# EAGLE design energy-harvesting-demoboard_v11 (EAGLE 6.4)

## Sheet 1 of 2
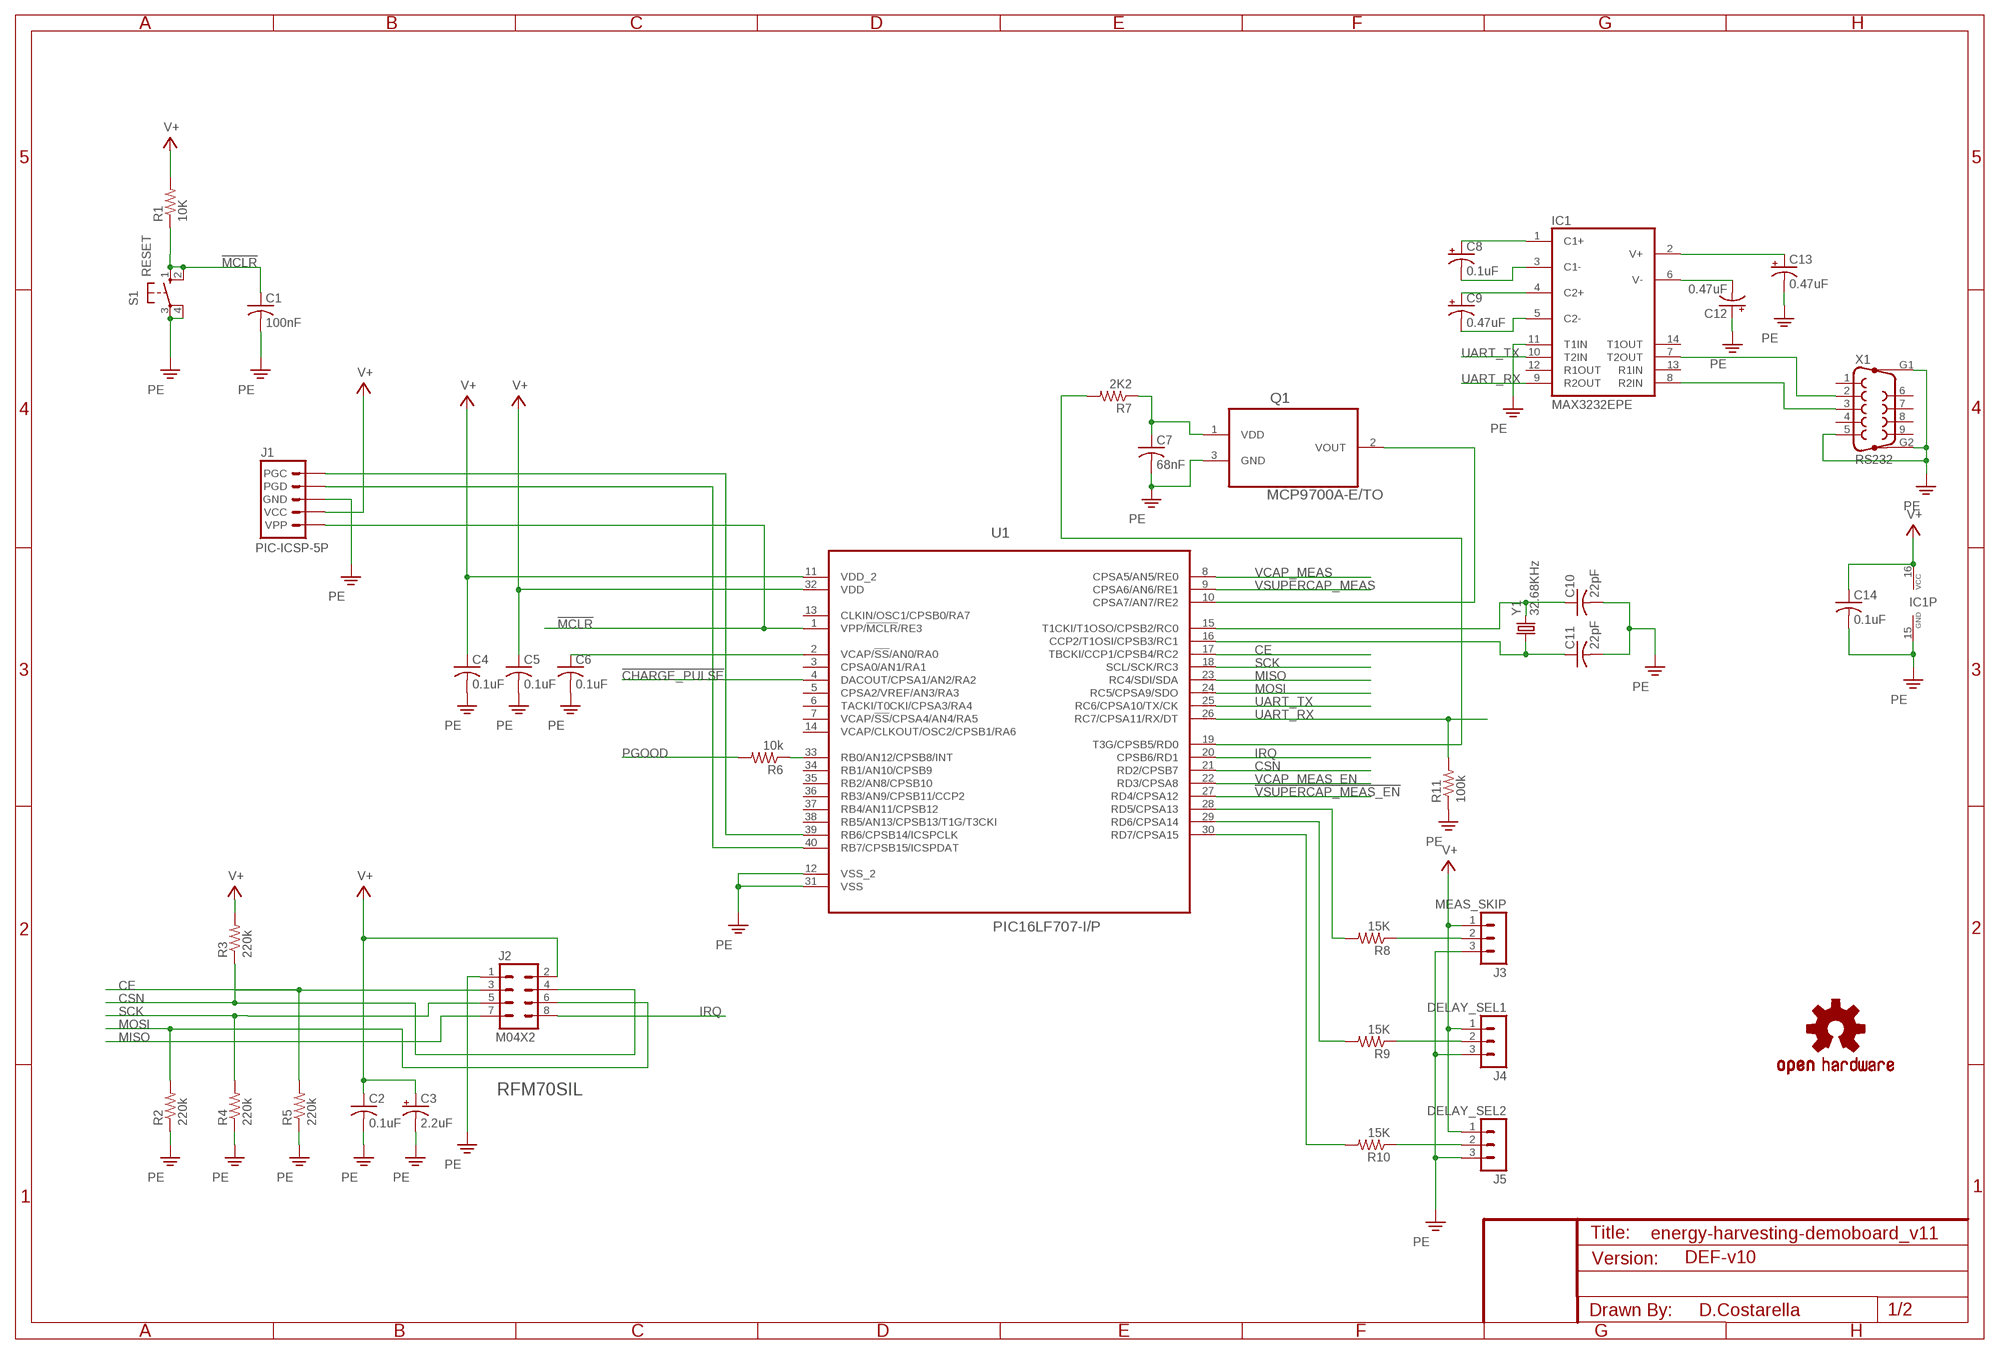
[diagram p0: schematic, sheet 1]

### Parts
C1  100nF  C-US025-025X050  [C025-025X050]
C2  0.1uF  C-US050-025X075  [C050-025X075]
C3  2.2uF  CPOL-USE2.5-5  [E2,5-5]
C4  0.1uF  C-US050-025X075  [C050-025X075]
C5  0.1uF  C-US050-025X075  [C050-025X075]
C6  0.1uF  C-US050-025X075  [C050-025X075]
C7  68nF  C-US050-035X075  [C050-035X075]
C8  0.1uF  CPOL-USE2.5-5  [E2,5-5]
C9  0.47uF  CPOL-USE2.5-5  [E2,5-5]
C10  22pF  C-US025-025X050  [C025-025X050]
C11  22pF  C-US025-025X050  [C025-025X050]
C12  0.47uF  CPOL-USE2.5-5  [E2,5-5]
C13  0.47uF  CPOL-USE2.5-5  [E2,5-5]
C14  0.1uF  C-US050-030X075  [C050-030X075]
IC1  MAX3232EPE  [DIL16]
J1  PIC-ICSP-5P  [1X05]
J2  M04X2  [2X4]
J3  MEAS_SKIP  MA03-1  [MA03-1]
J4  DELAY_SEL1  MA03-1  [MA03-1]
J5  DELAY_SEL2  MA03-1  [MA03-1]
LOGO1  OSHW-LOGOL  [OSHW-LOGO-L]
Q1  MCP9700A-E/TO  [TO127P254X533-3]
R1  10K  RESISTORPTH-1/4W  [AXIAL-0.4]
R2  220k  RESISTORPTH-1/4W  [AXIAL-0.4]
R3  220k  RESISTORPTH-1/4W  [AXIAL-0.4]
R4  220k  RESISTORPTH-1/4W  [AXIAL-0.4]
R5  220k  RESISTORPTH-1/4W  [AXIAL-0.4]
R6  10k  RESISTORPTH-1/4W  [AXIAL-0.4]
R7  2K2  RESISTORPTH-1/4W  [AXIAL-0.4]
R8  15K  RESISTORPTH-1/4W  [AXIAL-0.4]
R9  15K  RESISTORPTH-1/4W  [AXIAL-0.4]
R10  15K  RESISTORPTH-1/4W  [AXIAL-0.4]
R11  100k  RESISTORPTH-1/4W  [AXIAL-0.4]
S1  RESET  10-XX  [B3F-10XX]
U1  PIC16LF707-I/P  PIC16F707-I/P  [DIP254P1524X635-40]
X1  RS232  F09HP  [F09HP]
Y1  32.68KHz  CRYSTALTC26H_EZ  [TC26HEZ]

### Nets
!CHARGE_PULSE: U1.4(DACOUT/CPSA1/AN2/RA2) ; also sheet 2
!MCLR: C1.1 J1.1(VPP) R1.P$1 S1.1(S) S1.2(S1) U1.1(VPP/!MCLR!/RE3)
!VSUPERCAP_MEAS_EN: U1.27(RD4/CPSA12) ; also sheet 2
CE: J2.3 R5.P$2 U1.17(TBCKI/CCP1/CPSB4/RC2)
CSN: J2.4 R3.P$1 U1.21(RD2/CPSB7)
IRQ: J2.8 U1.20(CPSB6/RD1)
MISO: J2.7 U1.23(RC4/SDI/SDA)
MOSI: J2.6 R2.P$2 U1.24(RC5/CPSA9/SDO)
N$1: J1.5(PGC) U1.39(RB6/CPSB14/ICSPCLK)
N$2: J1.4(PGD) U1.40(RB7/CPSB15/ICSPDAT)
N$3: C6.1 U1.2(VCAP/!SS!/AN0/RA0)
N$4: C10.1 U1.15(T1CKI/T1OSO/CPSB2/RC0) Y1.2
N$5: C11.1 U1.16(CCP2/T1OSI/CPSB3/RC1) Y1.1
N$6: Q1.2(VOUT) U1.10(CPSA7/AN7/RE2)
N$7: J3.2 R8.P$1
N$8: R8.P$2 U1.28(RD5/CPSA13)
N$9: J4.2 R9.P$1
N$10: J5.2 R10.P$1
N$11: R9.P$2 U1.29(RD6/CPSA14)
N$12: R10.P$2 U1.30(RD7/CPSA15)
N$13: C7.1 Q1.1(VDD) R7.P$1
N$14: C8.+ IC1.1(C1+)
N$15: C8.- IC1.3(C1-)
N$16: C9.+ IC1.4(C2+)
N$17: C9.- IC1.5(C2-)
N$18: C12.- IC1.6(V-)
N$19: C13.+ IC1.2(V+)
N$20: IC1.8(R2IN) X1.3
N$25: IC1.7(T2OUT) X1.2
N$49: R6.P$1 U1.33(RB0/AN12/CPSB8/INT)
PE: C1.2 C2.2 C3.- C4.2 C5.2 C6.2 C7.2 C10.2 C11.2 C12.+ C13.- C14.2 IC1.11(T1IN) IC1.15(GND) J1.3(GND) J2.1 J3.3 J4.3 J5.3 Q1.3(GND) R2.P$1 R4.P$1 R5.P$1 R11.P$1 S1.3(P) S1.4(P1) U1.12(VSS_2) U1.31(VSS) X1.5 X1.G1 X1.G2 ; also sheet 2
PGOOD: R6.P$2 ; also sheet 2
SCK: J2.5 R4.P$2 U1.18(SCL/SCK/RC3)
SENS_EN: R7.P$2 U1.19(T3G/CPSB5/RD0)
UART_RX: IC1.9(R2OUT) R11.P$2 U1.26(RC7/CPSA11/RX/DT)
UART_TX: IC1.10(T2IN) U1.25(RC6/CPSA10/TX/CK)
V+: C2.1 C3.+ C4.1 C5.1 C14.1 IC1.16(VCC) J1.2(VCC) J2.2 J3.1 J4.1 J5.1 R1.P$2 R3.P$2 U1.11(VDD_2) U1.32(VDD) ; also sheet 2
VCAP_MEAS: U1.8(CPSA5/AN5/RE0) ; also sheet 2
VCAP_MEAS_EN: U1.22(RD3/CPSA8) ; also sheet 2
VSUPERCAP_MEAS: U1.9(CPSA6/AN6/RE1) ; also sheet 2
Unconnected: IC1.12(R1OUT) IC1.13(R1IN) IC1.14(T1OUT) U1.3(CPSA0/AN1/RA1) U1.5(CPSA2/VREF/AN3/RA3) U1.6(TACKI/T0CKI/CPSA3/RA4) U1.7(VCAP/!SS!/CPSA4/AN4/RA5) U1.13(CLKIN/OSC1/CPSB0/RA7) U1.14(VCAP/CLKOUT/OSC2/CPSB1/RA6) U1.34(RB1/AN10/CPSB9) U1.35(RB2/AN8/CPSB10) U1.36(RB3/AN9/CPSB11/CCP2) U1.37(RB4/AN11/CPSB12) U1.38(RB5/AN13/CPSB13/T1G/T3CKI) X1.1 X1.4 X1.6 X1.7 X1.8 X1.9

### Notes on the sheet
- RFM70SIL
- DEF-v10
- D.Costarella

## Sheet 2 of 2
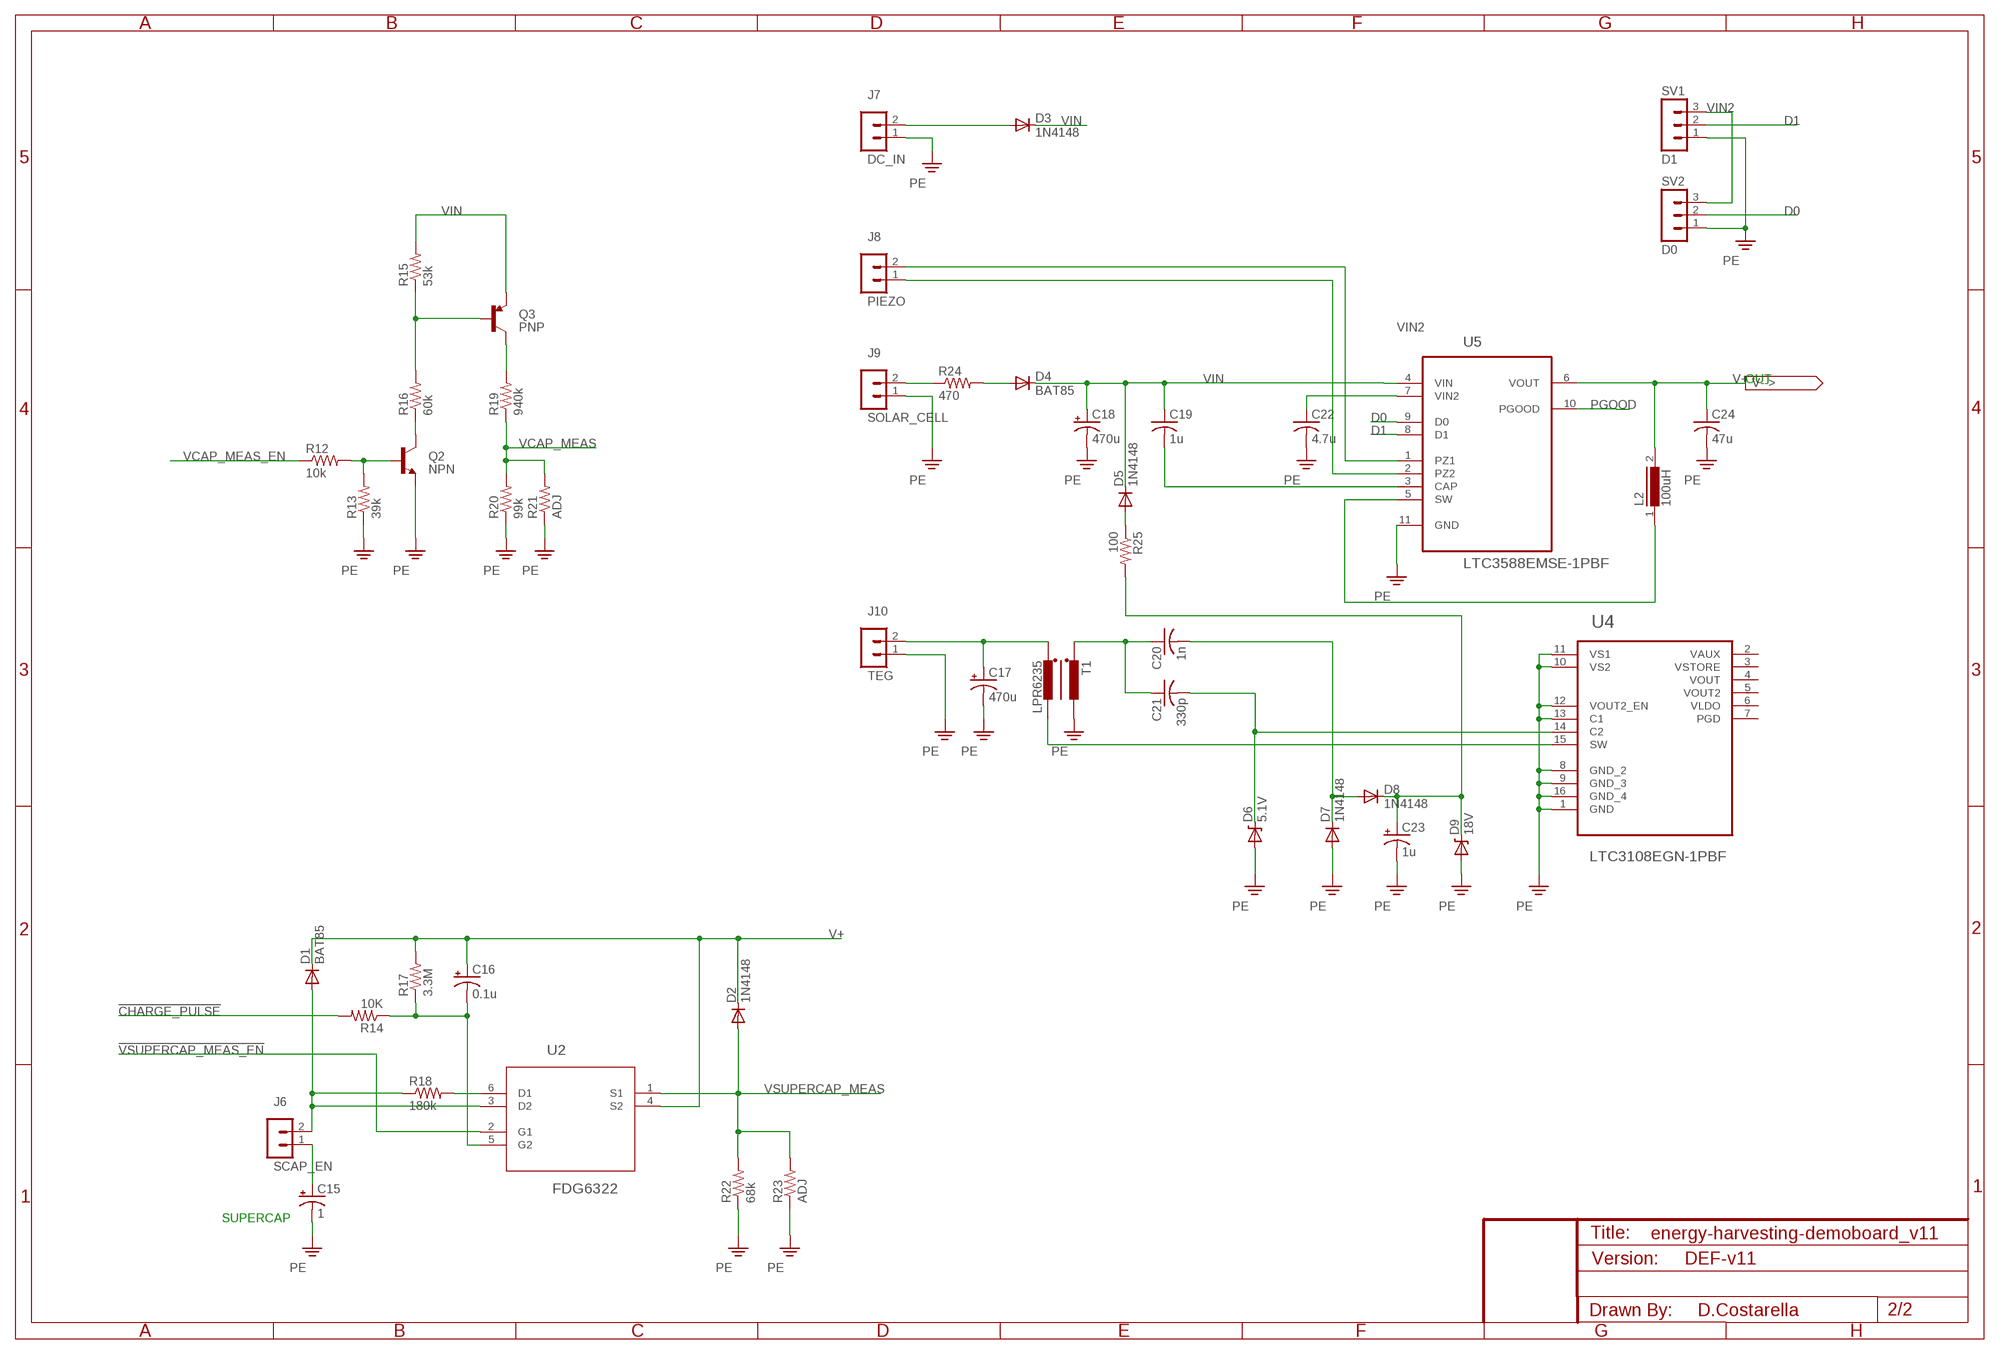
[diagram p1: schematic, sheet 2]

### Parts
C15  1  CPOL-USE5-8.5  [E5-8,5]
C16  0.1u  CPOL-USE2.5-5  [E2,5-5]
C17  470u  CPOL-USE5-10.5  [E5-10,5]
C18  470u  CPOL-USE5-10.5  [E5-10,5]
C19  1u  C-US050-035X075  [C050-035X075]
C20  1n  C-US050-030X075  [C050-030X075]
C21  330p  C-US050-030X075  [C050-030X075]
C22  4.7u  C-US025-024X044  [C025-024X044]
C23  1u  CPOL-USE2,5-6E  [E2,5-6E]
C24  47u  C-US050-025X075  [C050-025X075]
D1  BAT85  DIODE1N4148  [DIODE-1N4148]
D2  1N4148  DIODE1N4148  [DIODE-1N4148]
D3  1N4148  DIODESMA  [SMA-DIODE]
D4  BAT85  DIODE1N4148  [DIODE-1N4148]
D5  1N4148  DIODESMA  [SMA-DIODE]
D6  5.1V  DIODE-ZENERPTH  [DIODE-ZENER]
D7  1N4148  DIODE1N4148  [DIODE-1N4148]
D8  1N4148  DIODE1N4148  [DIODE-1N4148]
D9  18V  DIODE-ZENERPTH  [DIODE-ZENER]
J6  SCAP_EN  MA02-1  [MA02-1]
J7  DC_IN  MA02-1  [MA02-1]
J8  PIEZO  MA02-1  [MA02-1]
J9  SOLAR_CELL  MA02-1  [MA02-1]
J10  TEG  MA02-1  [MA02-1]
L2  100uH  DR125  [DR125]
Q2  NPN  TRANSISTOR_NPN_2PTH  [TO-92]
Q3  PNP  TRANSISTOR_PNPTO92  [TO-92]
R12  10k  RESISTORPTH-1/4W  [AXIAL-0.4]
R13  39k  RESISTORPTH-1/4W  [AXIAL-0.4]
R14  10K  RESISTORPTH-1/4W  [AXIAL-0.4]
R15  53k  RESISTORPTH-1/4W  [AXIAL-0.4]
R16  60k  RESISTORPTH-1/4W  [AXIAL-0.4]
R17  3.3M  RESISTORPTH-1/4W  [AXIAL-0.4]
R18  180k  RESISTORPTH-1/4W  [AXIAL-0.4]
R19  940k  RESISTORPTH-1/4W  [AXIAL-0.4]
R20  99k  RESISTORPTH-1/4W  [AXIAL-0.4]
R21  ADJ  RESISTORPTH-1/4W  [AXIAL-0.4]
R22  68k  RESISTORPTH-1/4W  [AXIAL-0.4]
R23  ADJ  RESISTORPTH-1/4W  [AXIAL-0.4]
R24  470  RESISTORPTH-1/4W  [AXIAL-0.4]
R25  100  RESISTORPTH-1/4W  [AXIAL-0.4]
SV1  D1  MA03-1  [MA03-1]
SV2  D0  MA03-1  [MA03-1]
T1  LPR6235  [LPR6235]
U2  FDG6322  BSS138PS  [SOT65P210X110-6N]
U4  LTC3108EGN-1PBF  [SOP63P600X175-16N]
U5  LTC3588EMSE-1PBF  [SOP50P490X110-11N]

### Nets
!CHARGE_PULSE: R14.P$2 ; also sheet 1
!VSUPERCAP_MEAS_EN: U2.2(G1) ; also sheet 1
D0: SV2.2 U5.9(D0)
D1: SV1.2 U5.8(D1)
N$21: Q2.2(B) R12.P$2 R13.P$2
N$22: Q2.1(C) R16.P$1
N$23: Q3.2(B) R15.P$1 R16.P$2
N$24: J8.1 U5.2(PZ2)
N$26: Q3.3(C) R19.P$2
N$27: D1.A J6.2 R18.P$1 U2.3(D2)
N$28: R18.P$2 U2.6(D1)
N$29: J9.2 R24.P$1
N$30: J8.2 U5.1(PZ1)
N$31: L2.1 U5.5(SW)
N$32: C19.2 U5.3(CAP)
N$34: C15.+ J6.1
N$36: C23.+ D8.C D9.P$1(C) R25.P$2
N$37: C21.2 D6.P$1(C) U4.14(C2)
N$38: D3.A J7.2
N$40: C17.+ J10.2 T1.P$1
N$41: D5.A R25.P$1
N$42: C20.2 D7.C D8.A
N$43: C16.- R14.P$1 R17.P$1 U2.5(G2)
N$44: D4.A R24.P$2
N$45: T1.P$2 U4.15(SW)
N$47: C20.1 C21.1 T1.P$4
PE: C15.- C17.- C18.- C22.2 C23.- C24.2 D6.P$2(A) D7.A D9.P$2(A) J7.1 J9.1 J10.1 Q2.3(E) R13.P$1 R20.P$1 R21.P$1 R22.P$1 R23.P$1 SV1.1 SV2.1 T1.P$3 U4.1(GND) U4.8(GND_2) U4.9(GND_3) U4.10(VS2) U4.11(VS1) U4.12(VOUT2_EN) U4.13(C1) U4.16(GND_4) U5.11(GND) ; also sheet 1
PGOOD: U5.10(PGOOD) ; also sheet 1
V+: C16.+ C24.1 D1.C D2.C L2.2 R17.P$2 U2.4(S2) U5.6(VOUT) ; also sheet 1
VCAP_MEAS: R19.P$1 R20.P$2 R21.P$2 ; also sheet 1
VCAP_MEAS_EN: R12.P$1 ; also sheet 1
VIN: C18.+ C19.1 D3.C D4.C D5.C Q3.1(E) R15.P$2 U5.4(VIN)
VIN2: C22.1 SV1.3 SV2.3 U5.7(VIN2)
VSUPERCAP_MEAS: D2.A R22.P$2 R23.P$2 U2.1(S1) ; also sheet 1
Unconnected: U4.2(VAUX) U4.3(VSTORE) U4.4(VOUT) U4.5(VOUT2) U4.6(VLDO) U4.7(PGD)

### Notes on the sheet
- OUT
- SUPERCAP
- DEF-v11
- D.Costarella

## Library data of the parts
C1 C2 C4-C7 C10 C11 C14 C19-C22 C24 = energy-harvesting:C-US: CAPACITOR, American symbol
C3 C8 C9 C12 C13 C15-C18 C23 = rcl:CPOL-US: POLARIZED CAPACITOR, American symbol
D1-D5 D7 D8 = SparkFun-DiscreteSemi:DIODE: Diode These are standard reverse protection diodes and small signal diodes. SMA package can handle up to about 1A. SOD-323 can handle about 200mA. What the SOD-323 package when ordering, there are some mfgs out there that are 5-pin packages.
D6 D9 = SparkFun-DiscreteSemi:DIODE-ZENER: Zener Diode Production Part - 8199 3.4V Zener Voltage
IC1 = maxim:MAX3232*: True RS-232 Transceivers 3.0V to 5.5V, Low-Power up to 1Mbps, Using Four 0.1µF External Capacitors Source: http://pdfserv.maxim-ic.com/en/ds/MAX3222-MAX3241.pdf; MPN: MAX3232EPE+; OC_FARNELL: unknown; OC_NEWARK: 67K4860
J1 = SparkFun-Connectors:PIC-ICSP-5P
J2 = SparkFun-Connectors:M04X2: .1" header, two rows of four.
J3-J5 SV1 SV2 = con-lstb:MA03-1: PIN HEADER; OC_FARNELL: unknown; OC_NEWARK: unknown
J6-J10 = con-lstb:MA02-1
L2 = inductors:DR125: High Power Density, High Efficiency, Shielded Inductors Source: coiltronics_dr_series.pdf
LOGO1 = SparkFun-Aesthetics:OSHW-LOGO: Open Source Hardware Logo This logo indicates the piece of hardware it is found on incorporates a OSHW license and/or adheres to the definition of open source hardware found here: http://freedomdefined.org/OSHW
Q1 = Microchip_By_element14_Batch_1:MCP9700A-E/TO: THERMISTOR, LINEAR 10MV/C; MPN: MCP9700A-E/TO; OC_FARNELL: 1332164; OC_NEWARK: 17M0676; PACKAGE: TO-92-3; SUPPLIER: Microchip
Q2 = SparkFun-DiscreteSemi:TRANSISTOR_NPN_2: Alternate TO-92 NPN BJT
Q3 = SparkFun-DiscreteSemi:TRANSISTOR_PNP: Generic PNP BJT. Double check pinouts against datasheets- not all devices are the same!
R1-R25 = SparkFun-Passives:RESISTOR: Resistor Basic schematic elements and footprints for 0603, 1206, and PTH resistors.
S1 = switch-omron:10-XX: OMRON SWITCH; MPN: B3F-1000; OC_FARNELL: 176432; OC_NEWARK: 36M3542
T1 = energy-harvesting:LPR6235
U1 = energy-harvesting:PIC16F707-I/P: 8-Bit CMOS Microcontrollers; MPN: PIC16F707-I/P; OC_FARNELL: 1814952; OC_NEWARK: 63R7804; PACKAGE: DIP-40; SUPPLIER: Microchip
U2 = NXP_By_element14_Batch_1:BSS138PS: Dual N-channel Trench MOSFET; MPN: BSS138PS; OC_FARNELL: 1972664; OC_NEWARK: 58T9002; PACKAGE: SOT-363-6; SUPPLIER: NXP
U4 = LTC_By_element14_Batch_1:LTC3108EGN-1PBF: Ultralow Voltage Step-Up Converter and Power Manager; MPN: LTC3108EGN-1#PBF; OC_FARNELL: 1839096; OC_NEWARK: 13T8313; PACKAGE: SSOP-16; SUPPLIER: Linear Technology
U5 = LTC_By_element14_Batch_1:LTC3588EMSE-1PBF: Piezoelectric Energy Harvesting Power Supply; MPN: LTC3588EMSE-1#PBF; OC_FARNELL: 1839154; OC_NEWARK: 63R1666; PACKAGE: MSOP-10; SUPPLIER: Linear Technology
X1 = con-subd:F09HP: SUB-D; OC_FARNELL: unknown; OC_NEWARK: unknown
Y1 = SparkFun-FreqCtrl:CRYSTAL: Various standard crystals. Proven footprints. Spark Fun Electronics SKU : COM-00534

## Board
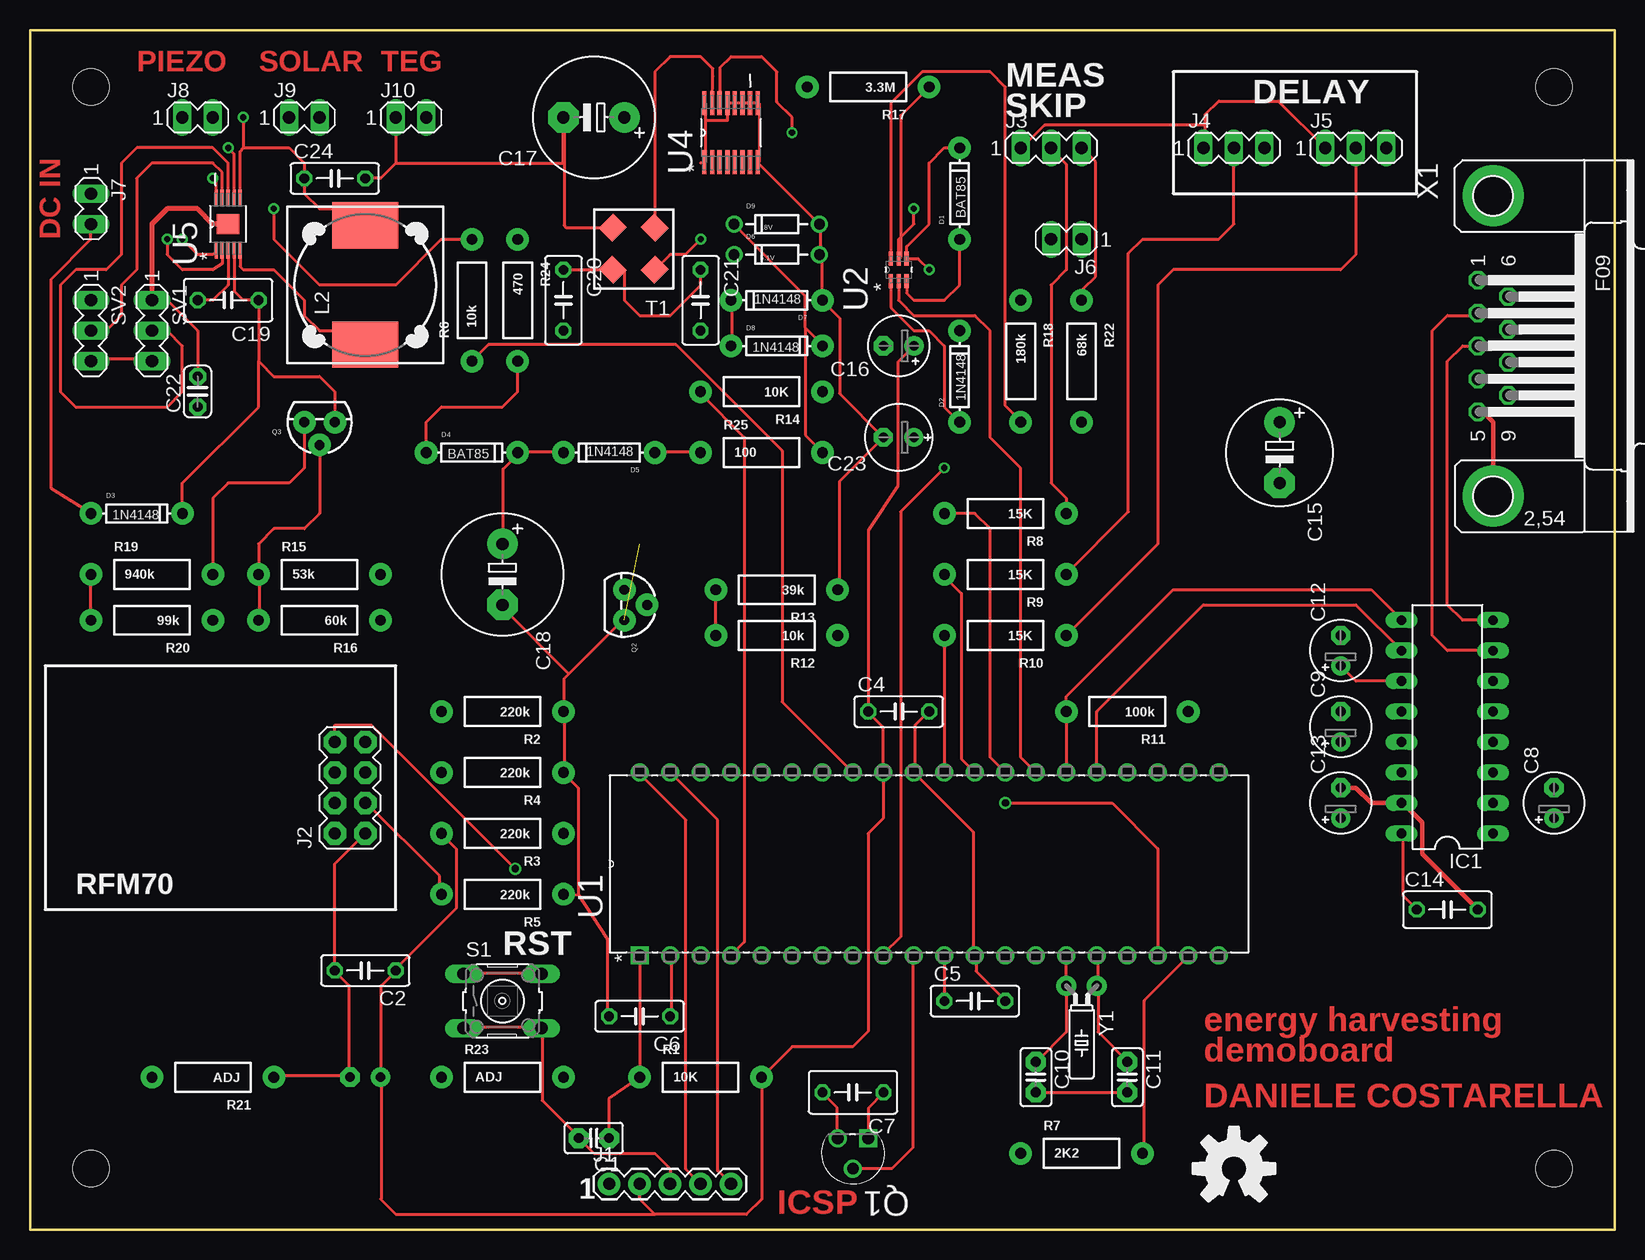
[diagram p2: board, top side]
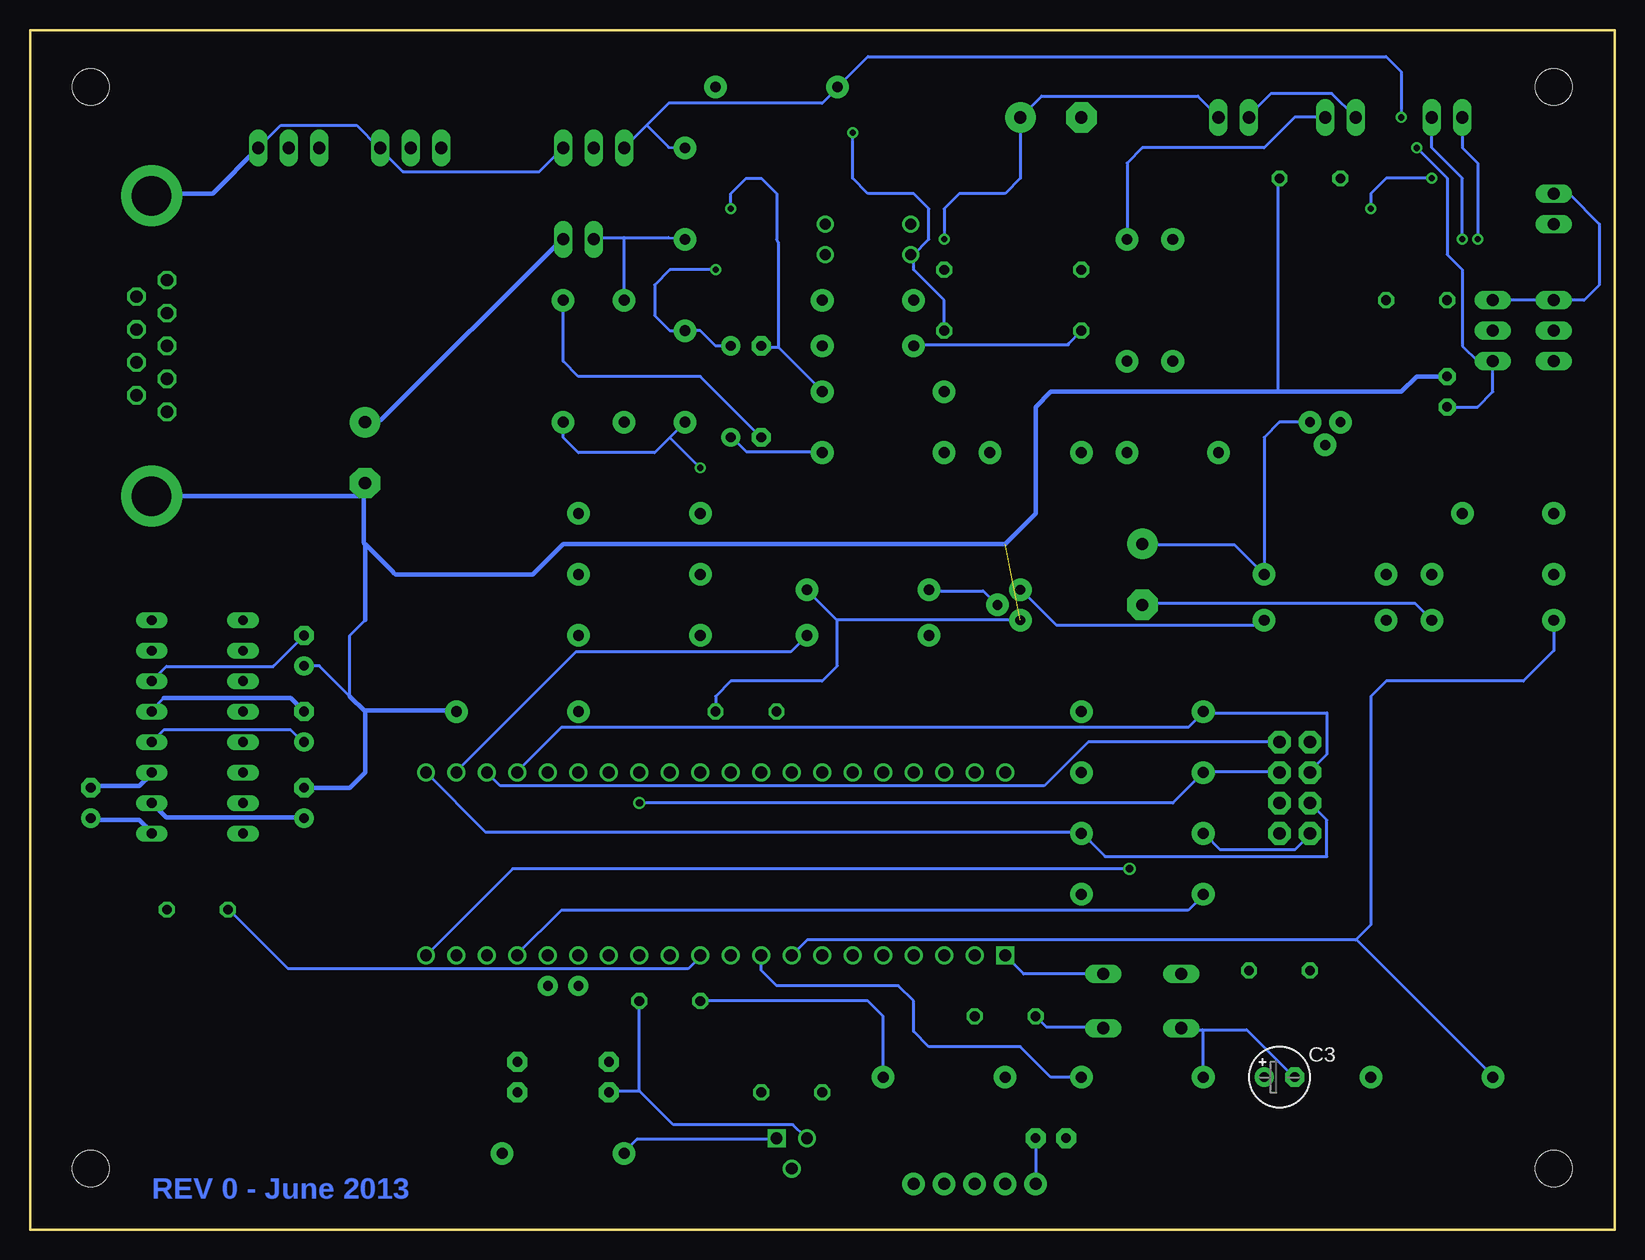
[diagram p3: board, bottom side, seen from below]

Size 132.06 x 100 mm. Coordinates in mm from the lower left corner, seen from the top.
Outline: 0,0 132.06,0 132.06,100 0,100 0,0
Copper layers (1*16): Top 0.035mm / dielectric 1.5mm / Bottom 0.035mm
Design rules "default": minimum track width 10mil, minimum drill 24mil, track to track 8mil, track to pad 8mil, pad to pad 8mil, via to via 8mil, smd to smd 8mil, copper to edge 40mil, drill to drill 8mil, minimum pad ring 10mil, minimum via ring 8mil, stop-mask expansion 4mil, vias tented up to drill 0mil, thermal gap 10mil
Holes 3.05 mm at 127,95.25 127,5.08 5.08,5.08 5.08,95.25

### Footprints (pad centres in the part's own frame; a part is rotated, then mirrored left to right if it is on the bottom)
C025-025X050 = drill 0.813 pad 1.676 octagon: 1 -1.27,0; 2 1.27,0
C050-025X075 = drill 0.813 octagon: 1 -2.54,0; 2 2.54,0
E2,5-5 = drill 0.813 pad 1.6: + -1.27,0 | drill 0.813 pad 1.6 octagon: - 1.27,0
C050-035X075 = drill 0.813 octagon: 1 -2.54,0; 2 2.54,0
C050-030X075 = drill 0.813 octagon: 1 -2.54,0; 2 2.54,0
E5-8,5 = drill 1.016 pad 2.54: + -2.54,0 | drill 1.016 pad 2.54 octagon: - 2.54,0
E5-10,5 = drill 1.016 pad 2.54: + -2.54,0 | drill 1.016 pad 2.54 octagon: - 2.54,0
C025-024X044 = drill 0.813 pad 1.422 octagon: 1 -1.27,0; 2 1.27,0
E2,5-6E = drill 0.813 pad 1.575: + -1.27,0 | drill 0.813 pad 1.575 octagon: - 1.27,0
DIODE-1N4148 = drill 0.9 pad 1.88: A -3.81,0; C 3.81,0
DIODE-ZENER = drill 0.9: P$1 -3.556,0; P$2 3.556,0
DIL16 = drill 0.813 long: 1 -8.89,-3.81; 2 -6.35,-3.81; 3 -3.81,-3.81; 4 -1.27,-3.81; 5 1.27,-3.81; 6 3.81,-3.81; 7 6.35,-3.81; 8 8.89,-3.81; 9 8.89,3.81; 10 6.35,3.81; 11 3.81,3.81; 12 1.27,3.81; 13 -1.27,3.81; 14 -3.81,3.81; 15 -6.35,3.81; 16 -8.89,3.81
1X05 = drill 1.016 pad 1.88: 1 0,0; 2 2.54,0; 3 5.08,0; 4 7.62,0; 5 10.16,0
2X4 = drill 1.016 pad 1.88 octagon: 1 -3.81,-1.27; 2 -3.81,1.27; 3 -1.27,-1.27; 4 -1.27,1.27; 5 1.27,-1.27; 6 1.27,1.27; 7 3.81,-1.27; 8 3.81,1.27
MA03-1 = drill 1.016 long: 1 -2.54,0; 2 0,0; 3 2.54,0
MA02-1 = drill 1.016 long: 1 -1.27,0; 2 1.27,0
DR125 = smd 3.85 x 5.5: 1 -4.975,0; 2 4.975,0
TO127P254X533-3 = drill 0.991 square: 1 -2.54,-2.54 | drill 0.991: 2 -1.27,0; 3 0,-2.54
TO-92 = drill 0.813 pad 1.88: 1 -1.27,0; 2 0,1.905; 3 1.27,0
AXIAL-0.4 = drill 0.9 pad 1.88: P$1 -5.08,0; P$2 5.08,0
B3F-10XX = drill 1.016 long: 1 -3.251,2.261; 2 3.251,2.261; 3 -3.251,-2.261; 4 3.251,-2.261
LPR6235 = smd 1.7 x 1.6 rotated 45: P$1 0,0; P$3 3.5,-3.5 | smd 1.7 x 1.6 rotated 135: P$2 0,-3.5; P$4 3.5,0
DIP254P1524X635-40 = drill 0.991 square: 1 -7.62,24.13 | drill 0.991: 2 -7.62,21.59; 3 -7.62,19.05; 4 -7.62,16.51; 5 -7.62,13.97; 6 -7.62,11.43; 7 -7.62,8.89; 8 -7.62,6.35; 9 -7.62,3.81; 10 -7.62,1.27; 11 -7.62,-1.27; 12 -7.62,-3.81; 13 -7.62,-6.35; 14 -7.62,-8.89; 15 -7.62,-11.43; 16 -7.62,-13.97; 17 -7.62,-16.51; 18 -7.62,-19.05; 19 -7.62,-21.59; 20 -7.62,-24.13; 21 7.62,-24.13; 22 7.62,-21.59; 23 7.62,-19.05; 24 7.62,-16.51; 25 7.62,-13.97; 26 7.62,-11.43; 27 7.62,-8.89; 28 7.62,-6.35; 29 7.62,-3.81; 30 7.62,-1.27; 31 7.62,1.27; 32 7.62,3.81; 33 7.62,6.35; 34 7.62,8.89; 35 7.62,11.43; 36 7.62,13.97; 37 7.62,16.51; 38 7.62,19.05; 39 7.62,21.59; 40 7.62,24.13
SOT65P210X110-6N = smd 1.168 x 0.356: 1 -0.94,0.66; 2 -0.94,0; 3 -0.94,-0.66; 4 0.94,-0.66; 5 0.94,0; 6 0.94,0.66
SOP63P600X175-16N = smd 1.981 x 0.356: 1 -2.464,2.235; 2 -2.464,1.575; 3 -2.464,0.965; 4 -2.464,0.305; 5 -2.464,-0.305; 6 -2.464,-0.965; 7 -2.464,-1.575; 8 -2.464,-2.235; 9 2.464,-2.235; 10 2.464,-1.575; 11 2.464,-0.965; 12 2.464,-0.305; 13 2.464,0.305; 14 2.464,0.965; 15 2.464,1.575; 16 2.464,2.235
SOP50P490X110-11N = smd 1.397 x 0.279: 1 -2.184,0.991; 2 -2.184,0.508; 3 -2.184,0; 4 -2.184,-0.508; 5 -2.184,-0.991; 6 2.184,-0.991; 7 2.184,-0.508; 8 2.184,0; 9 2.184,0.508; 10 2.184,0.991 | smd 1.676 x 1.88: 11 0,0
F09HP = drill 1.016 octagon: 1 -5.486,-1.27; 2 -2.743,-1.27; 3 0,-1.27; 4 2.743,-1.27; 5 5.486,-1.27; 6 -4.115,1.27; 7 -1.372,1.27; 8 1.372,1.27; 9 4.115,1.27 | drill 3.302 pad 5.08: G1 -12.522,0; G2 12.522,0
TC26HEZ = drill 0.813 pad 1.676: 1 -1.27,0; 2 1.27,0

### Placement (x,y rotation side)
C1  46.99,7.62 180 top
C2  27.94,21.59 180 top
C3  27.94,12.7 0 bottom
C4  72.39,43.18 0 top
C5  78.74,19.05 0 top
C6  50.8,17.78 180 top
C7  68.58,11.43 180 top
C8  127,35.56 90 top
C9  109.22,41.91 90 top
C10  83.82,12.7 270 top
C11  91.44,12.7 270 top
C12  109.22,48.26 90 top
C13  109.22,35.56 90 top
C14  118.11,26.67 0 top
C15  104.14,64.77 270 top
C16  72.39,73.66 180 top
C17  46.99,92.71 180 top
C18  39.37,54.61 270 top
C19  16.51,77.47 180 top
C20  44.45,77.47 270 top
C21  55.88,77.47 270 top
C22  13.97,69.85 90 top
C23  72.39,66.04 180 top
C24  25.4,87.63 0 top
D1  77.47,86.36 90 top
D2  77.47,71.12 90 top
D3  1N4148  [DIODE-1N4148]  8.89,59.69 0 top
D4  36.83,64.77 0 top
D5  1N4148  [DIODE-1N4148]  48.26,64.77 180 top
D6  62.23,81.28 0 top
D7  62.23,77.47 180 top
D8  62.23,73.66 0 top
D9  62.23,83.82 0 top
IC1  118.11,41.91 90 top
J1  48.26,3.81 0 top
J2  26.67,36.83 90 top
J3  85.09,90.17 0 top
J4  100.33,90.17 0 top
J5  110.49,90.17 0 top
J6  86.36,82.55 180 top
J7  5.08,85.09 270 top
J8  13.97,92.71 0 top
J9  22.86,92.71 0 top
J10  31.75,92.71 0 top
L2  27.94,78.74 90 top
LOGO1  100.33,5.08 0 top
Q1  67.31,5.08 180 top
Q2  49.53,52.07 270 top
Q3  24.13,67.31 180 top
R1  55.88,12.7 0 top
R2  39.37,43.18 180 top
R3  39.37,33.02 180 top
R4  39.37,38.1 180 top
R5  39.37,27.94 180 top
R6  36.83,77.47 90 top
R7  87.63,6.35 0 top
R8  81.28,59.69 180 top
R9  81.28,54.61 180 top
R10  81.28,49.53 180 top
R11  91.44,43.18 180 top
R12  62.23,49.53 180 top
R13  62.23,53.34 180 top
R14  60.96,69.85 180 top
R15  24.13,54.61 0 top
R16  24.13,50.8 180 top
R17  69.85,95.25 180 top
R18  82.55,72.39 270 top
R19  10.16,54.61 0 top
R20  10.16,50.8 180 top
R21  15.24,12.7 180 top
R22  87.63,72.39 270 top
R23  39.37,12.7 0 top
R24  40.64,77.47 270 top
R25  60.96,64.77 0 top
S1  39.37,19.05 0 top
SV1  10.16,74.93 270 top
SV2  5.08,74.93 270 top
T1  52.07,80.01 180 top
U1  74.93,30.48 90 top
U2  72.39,80.01 90 top
U4  58.42,91.44 90 top
U5  16.51,83.82 90 top
X1  121.92,73.66 270 top
Y1  87.63,20.32 180 top

### Tracks (layer width: path | path; a pad name or v marks a point on that pad's centre or on a via)
!CHARGE_PULSE
  Top 0.254: U1.4 59.54,23.98 59.54,66.04 55.88,69.7 R14.P$2
!MCLR
  Top 0.254: S1.1 36.17,21.34 42.47,21.34 S1.2 | U1.1 R1.P$1 48.26,10.92 C1.1
  Bottom 0.254: C1.1 J1.1 | S1.2 49.25,21.31 U1.1
!VSUPERCAP_MEAS_EN
  Top 0.254: U1.27 82.55,39.37 82.55,63.5 80.01,66.04 80.01,74.93 78.74,76.2 73.66,76.2 72.39,77.47 U2.2
CE
  Top 0.254: J2.3 28.04,35.56 34.14,29.46 34.14,28.04 R5.P$2
  Bottom 0.254: U1.17 91.44,22.96 87.78,26.62 35.56,26.62 34.34,27.84 R5.P$2
CSN
  Bottom 0.254: U1.21 94.08,33.12 44.5,33.12 R3.P$1 44.3,32.92 42.47,31.09 23.98,31.09 23.98,34.14 J2.4
D0
  Top 0.254: U5.9 16,88.14 15.24,88.9 10.16,88.9 8.89,87.63 8.89,80.01 7.62,78.74 7.62,76.2 6.35,74.93 SV2.2
D1
  Top 0.254: SV1.2 11.43,74.93 12.7,73.66 12.7,69.85 11.43,68.58 3.81,68.58 2.54,69.85 2.54,78.74 3.81,80.01 6.35,80.01 7.62,81.28 7.62,88.9 8.89,90.17 15.24,90.17 16.51,88.9 U5.8
IRQ  (via drill 0.61)
  Top 0.254: v40.44,30.07 28.45,42.06 25.4,42.06 J2.8
  Bottom 0.254: U1.20 91.85,30.07 v40.44,30.07
MISO
  Bottom 0.254: U1.23 92.86,36.98 47.55,36.98 43.89,40.64 J2.7
MOSI
  Bottom 0.254: U1.24 91.44,38.2 87.78,41.86 35.56,41.86 34.34,43.08 R2.P$2 34.14,43.08 23.98,43.08 23.98,39.62 25.4,38.2 J2.6
N$1
  Top 0.254: U1.39 57.3,34.14 57.3,4.88 57.35,4.88 J1.5
N$2
  Top 0.254: U1.40 50.8,38 54.66,34.14 54.66,5.03 J1.4
N$3
  Top 0.254: C6.1 53.44,17.88 53.44,22.76 U1.2
N$4
  Top 0.254: U1.15 Y1.2 86.36,16.46 83.92,14.02 C10.1
N$5
  Top 0.254: 89,20.32 89,22.76 U1.16 | 89,20.32 89,16.46 91.44,14.02 C11.1 | 89,20.32 Y1.1
N$6
  Top 0.254: Q1.2 71.83,5.08 73.56,6.81 73.56,22.76 U1.10
N$7
  Top 0.254: J3.2 85.14,90.02 86.36,88.8 86.36,80.01 85.09,78.74 85.09,62.23 86.36,60.96 R8.P$1
N$8
  Top 0.254: U1.28 81.28,38.2 81.18,38.2 80.01,39.37 80.01,58.42 78.74,59.69 R8.P$2 76.2,59.54
N$9
  Top 0.254: R9.P$1 86.36,54.66 91.54,59.84 91.54,81.38 92.71,82.55 99.06,82.55 100.33,83.82 J4.2
N$10
  Top 0.254: 86.36,49.58 R10.P$1 93.98,57.15 93.98,78.74 95.25,80.01 109.22,80.01 110.49,81.28 J5.2
N$11
  Top 0.254: U1.29 77.62,39.22 77.62,53.03 76.2,54.46 R9.P$2
N$12
  Top 0.254: R10.P$2 U1.30
N$13
  Top 0.254: C7.1 71.12,11.38 69.9,10.16 69.9,7.72 Q1.1
  Bottom 0.254: R7.P$1 82.5,6.5 81.48,7.52 69.9,7.52 Q1.1
N$14
  Bottom 0.254: 121.92,33.12 IC1.1 | 127,34.14 C8.+
  Bottom 0.381: 121.92,33.12 122.94,34.14 127,34.14
N$15
  Bottom 0.254: 121.92,38 IC1.3 | 127,36.98 C8.-
  Bottom 0.381: 121.92,38 122.94,36.98 127,36.98
N$16
  Bottom 0.254: IC1.4 120.9,41.66 110.34,41.66 109.32,40.64 C9.+
N$17
  Bottom 0.254: 120.9,44.3 121.92,43.28 IC1.5
  Bottom 0.381: 120.9,44.3 110.34,44.3 C9.-
N$18
  Bottom 0.254: IC1.6 120.7,46.94 111.76,46.94 111.76,46.99 C12.-
N$19
  Bottom 0.254: 109.32,34.34 C13.+
  Bottom 0.381: IC1.2 120.7,34.34 109.32,34.34
N$20
  Top 0.254: IC1.8 119.38,50.8 118.11,52.07 118.11,72.39 119.38,73.66 X1.3
N$21
  Top 0.254: R12.P$2 57.1,49.58 57.1,53.24 R13.P$2
  Bottom 0.254: Q2.2 51.61,52.22 52.63,53.24 57.1,53.24 R13.P$2
N$22
  Bottom 0.254: R16.P$1 29.26,50.8 29.67,50.39 46.53,50.39 49.38,53.24 Q2.1
N$23
  Top 0.254: R16.P$2 19.1,50.8 19.1,54.46 R15.P$1 19.05,57.15 20.32,58.42 22.86,58.42 24.13,59.69 Q3.2
N$24  (via drill 0.51)
  Top 0.254: v11.43,82.55 11.43,81.28 12.7,80.01 15.24,80.01 16,80.52 U5.2
  Bottom 0.254: J8.1 12.7,90.17 11.43,88.9 v11.43,82.55
N$25
  Top 0.254: IC1.7 118.11,48.26 116.84,49.53 116.84,74.93 118.11,76.2 120.7,76.2 120.7,76.4 X1.2
N$26
  Top 0.254: 15.24,54.66 R19.P$2 15.24,60.96 16.51,62.23 21.59,62.23 22.86,63.5 Q3.3
N$27
  Top 0.254: U2.3 73.05,78.08 73.66,77.47 76.2,77.47 77.47,78.74 D1.A
  Bottom 0.254: 82.55,82.7 84.94,82.7 J6.2 | 82.55,82.7 78.84,82.7 D1.A | R18.P$1 82.55,82.7
N$28
  Top 0.254: U2.6 71.73,93.88 74.37,96.52 80.01,96.52 81.28,95.25 81.28,68.68 82.5,67.46 R18.P$2
N$29
  Bottom 0.254: J9.2 26.67,92.71 29.21,90.17 39.37,90.17 40.64,88.9 R24.P$1
N$30  (via drill 0.51)
  Top 0.254: U5.1 15.52,81.56 15.24,81.28 13.97,81.28 v12.7,82.55
  Bottom 0.254: v12.7,82.55 12.7,87.63 15.24,90.17 J8.2
N$31
  Top 0.254: U5.5 17.5,80.29 17.78,80.01 20.32,80.01 22.86,77.47 22.86,76.2 24.13,74.93 26.77,74.93 L2.1
N$32
  Top 0.254: U5.3 16.51,78.74 15.24,77.47 C19.2
N$34
  Bottom 0.254: 102.82,67.46 104.04,67.46 C15.+ | 87.78,82.5 J6.1
  Bottom 0.381: 102.82,67.46 87.78,82.5
N$36
  Top 0.254: 64.62,75.18 64.62,77.83 58.73,83.72 D9.P$1 | 64.62,75.18 66.04,73.76 D8.C | 64.62,75.18 64.62,66.24 66.04,64.82 R25.P$2
  Bottom 0.254: C23.+ 73.56,66.04 72.34,64.82 66.04,64.82 R25.P$2
N$37  (via drill 0.51)
  Top 0.254: U4.14 57.51,94.08 57.51,96.88 58.42,97.79 60.96,97.79 62.23,96.52 62.23,93.98 63.5,92.71 v63.5,91.44
  Bottom 0.254: C21.2 55.88,77.47 58.42,80.01 58.42,81.03 D6.P$1 58.42,81.28 57.15,82.55 57.15,85.09 58.42,86.36 62.23,86.36 63.5,87.63 v63.5,91.44
N$38
  Top 0.254: 5.08,83.72 J7.2 5.08,82.55 1.78,79.25 1.78,61.77 5.08,59.74 D3.A
N$40  (via drill 0.51)
  Top 0.254: v55.88,82.55 54.61,81.28 53.34,81.28 T1.P$1
  Bottom 0.254: J10.2 33.12,92.86 34.75,94.49 47.75,94.49 C17.+ 49.53,87.63 50.8,86.36 54.61,86.36 55.88,85.09 v55.88,82.55
N$41
  Top 0.254: D5.A 52.22,64.82 55.88,64.82 R25.P$1
N$42
  Top 0.254: D7.C 58.52,77.42 58.52,73.76 D8.A
  Bottom 0.254: D8.A 58.32,73.76 45.52,73.76 45.52,73.86 C20.2
N$43  (via drill 0.51)
  Top 0.254: R17.P$1 72.54,92.86 72.54,81.08 U2.5 72.39,82.55 73.66,83.82 v73.66,85.09
  Bottom 0.254: 69.7,73.56 66.04,69.9 R14.P$1 | 69.7,73.56 71.12,73.56 C16.- | 69.7,73.56 69.7,82.3 69.85,82.55 69.85,86.36 71.12,87.63 72.39,87.63 73.66,86.36 v73.66,85.09
N$44
  Top 0.254: D4.A 33.02,67.31 34.29,68.58 39.37,68.58 40.64,69.85 R24.P$2
N$45
  Top 0.254: U4.15 56.9,96.14 56.9,96.77 55.88,97.79 53.34,97.79 52.07,96.52 T1.P$2
N$47
  Top 0.254: C20.1 T1.P$4 49.53,80.01 49.53,77.47 50.8,76.2 53.34,76.2 55.88,78.74 C21.1
N$49
  Top 0.254: U1.33 62.69,43.99 62.69,64.92 53.85,73.76 38.2,73.76 R6.P$1
PE  (1 unrouted)
  Top 0.254: J3.3 88.8,89 88.8,79.45 87.78,78.44 87.78,77.62 R22.P$1 | 114.4,35.56 IC1.15 | 109.32,36.98 C13.- | R13.P$1 67.46,53.44 67.46,62.38 C23.- 67.46,69.7 67.46,76 66.04,77.42 D7.A 66.04,81.08 65.84,81.28 | 56.29,92.46 56.29,93.88 U4.16 | 56.29,92.46 56.29,89 U4.1 55.88,88.9 | 58.73,93.88 58.12,93.88 | 58.73,93.88 59.33,93.88 U4.11 59.54,93.88 59.94,93.88 U4.10 60.15,93.88 60.55,93.88 U4.9 60.76,93.88 60.76,89 U4.8 60.76,88.8 65.63,83.92 D9.P$2 65.84,83.72 65.84,81.28 | 58.73,93.88 U4.12 | 56.29,92.46 58.12,92.46 58.12,93.88 | 58.12,93.88 U4.13 | 65.84,81.28 D6.P$2 | 44.91,46.33 44.5,45.92 44.5,43.28 R2.P$1 44.5,43.08 44.5,38.2 R4.P$1 44.5,38 45.72,36.78 45.72,27.89 | 44.91,46.33 49.38,50.8 Q2.3 | 44.91,46.33 39.42,51.82 39.42,52.02 C18.- | C4.2 74.78,43.08 73.76,42.06 73.76,38.2 U1.31 78.64,33.12 78.64,22.96 U1.12 78.84,22.76 78.84,21.54 81.28,19.1 C5.2 | C10.2 83.92,11.38 91.44,11.38 C11.2 | 26.62,12.8 26.62,20.32 25.4,21.54 C2.2 25.4,30.48 J2.1 | C7.2 66.04,11.38 67.26,10.16 67.26,7.72 Q1.3 | S1.3 36.17,16.87 42.47,16.87 S1.4 42.67,16.66 42.67,10.77 45.72,7.72 C1.2 46.99,6.35 52.07,6.35 53.34,5.08 J1.3 | 45.72,27.89 48.16,24.18 48.16,17.88 C6.2 | 45.72,27.89 44.5,27.84 R5.P$1 | 26.62,12.8 20.32,12.8 R21.P$1 | 26.62,12.8 C3.- | SV1.1 11.43,77.47 13.97,74.93 C22.2 | J10.1 30.48,88.9 | 30.48,88.9 29.21,87.63 C24.2 | 30.48,88.9 44.45,88.9 C17.- 44.5,92.66 44.5,83.72 44.7,83.52 T1.P$3 | IC1.11 110.49,45.72 C12.+
  Top 0.381: X1.G2 121.92,67.31 121.06,68.17 X1.5 | C14.2 116.03,31.29 116.03,33.93 114.4,35.56 | C13.- 110.49,36.83 111.76,35.56 IC1.15
  Top 0.406: U5.11 15.24,83.82 13.97,85.09 11.43,85.09 10.16,83.82 SV1.1
  Bottom 0.254: J5.3 111.15,92.05 104.85,92.05 103.02,90.22 J4.3 102.82,90.02 100.99,88.19 89.61,88.19 J3.3 | 121.92,86.36 X1.G1 | 104.24,62.18 C15.- 104.24,61.16 | 121.92,61.16 X1.G2 | J10.1 30.48,92.86 28.65,94.69 23.57,94.69 J9.1 21.59,91.44 | R20.P$1 16.66,52.22 39.22,52.22 C18.- | 81.28,11.58 C5.2 | 81.28,11.58 83.72,11.58 C10.2 | C6.2 47.35,16.87 42.67,16.87 S1.4 | 34.34,16.66 35.97,16.66 S1.3 | 34.34,16.66 30.68,16.66 26.82,12.8 C3.- | 81.28,11.58 78.44,8.74 68.48,8.74 67.46,7.72 Q1.3 | 64.82,50.8 67.26,53.24 R13.P$1 | Q2.3 64.82,50.8 | C23.- 76.2,71.12 86.36,71.12 87.63,72.39 R22.P$1 | 101.6,54.61 101.73,54.74 101.8,54.66 101.8,54.81 | 96.52,43.28 R11.P$1 | 104.14,50.8 105.41,49.53 105.41,44.45 107.95,46.99 C12.+ | 104.04,43.28 104.14,43.18 | 104.14,57.15 104.24,57.1 104.24,57.25 | SV1.1 SV2.1 2.54,77.47 1.27,78.74 1.27,83.82 3.81,86.36 J7.1 | 34.34,16.66 34.34,12.8 R23.P$1 | 64.82,50.8 64.82,47.04 64.77,46.99 66.04,45.72 73.66,45.72 74.93,44.45 C4.2 | 28.04,69.85 28.04,87.58 C24.2
  Bottom 0.381: J5.3 116.84,86.36 121.92,86.36 | 104.24,61.16 104.24,62.18 | 104.24,61.16 121.92,61.16 | 104.24,61.16 104.24,57.25 | 101.6,54.61 90.17,54.61 87.63,57.15 50.8,57.15 48.26,59.69 48.26,68.58 46.99,69.85 28.04,69.85 17.78,69.85 16.51,71.12 C22.2 | 101.8,54.81 104.14,57.15 104.14,50.8 | 96.52,43.28 104.04,43.28 | 105.41,44.45 104.14,43.18 104.14,38.1 105.41,36.83 C13.-
PGOOD  (via drill 0.51)
  Top 0.254: U5.10 15.52,87.35 v15.24,87.63 | v20.32,85.09 20.32,82.55 24.13,78.74 30.48,78.74 34.29,82.55 R6.P$2
  Bottom 0.254: v15.24,87.63 19.05,87.63 20.32,86.36 v20.32,85.09
SCK  (via drill 0.61)
  Top 0.254: v81.28,35.56 90.17,35.56 93.98,31.75 U1.18
  Bottom 0.254: J2.5 28.04,38.2 34.14,38.2 R4.P$2 36.83,35.56 v81.28,35.56
SENS_EN
  Top 0.254: U1.19 96.52,22.76 92.86,19.1 92.86,6.5 R7.P$2
UART_RX
  Top 0.254: U1.26 R11.P$2 86.36,44.45 95.25,53.34 111.76,53.34 IC1.9
UART_TX
  Top 0.254: U1.25 88.9,43.18 97.79,52.07 110.49,52.07 IC1.10
V+  (via drill 0.51)
  Top 0.254: J5.1 104.04,94.08 99.06,94.08 97.94,92.96 97.94,92.05 | 97.94,92.05 97.94,90.22 J4.1 | 29.26,12.8 29.26,20.32 30.48,21.54 C2.1 30.48,21.74 35.56,26.82 35.56,31.7 34.34,32.92 R3.P$2 | 29.26,12.8 C3.+ | C14.1 114.4,27.84 114.4,32.92 IC1.16 | U1.11 C5.1 | C16.+ 72.34,72.34 72.34,62.03 69.9,58.32 69.9,43.28 C4.1 69.9,43.08 71.12,41.86 U1.32 71.12,34.29 69.85,33.02 69.85,16.51 68.58,15.24 63.5,15.24 R1.P$2 60.96,2.54 59.69,1.27 52.07,1.27 | 97.94,92.05 84.53,92.05 82.7,90.22 J3.1 | 52.07,1.27 50.8,2.54 J1.2 | 29.26,12.8 29.26,2.59 29.21,2.54 30.48,1.27 52.07,1.27 | U5.6 17.5,89.89 17.78,90.17 | 17.78,90.17 21.59,90.17 22.86,88.9 C24.1 22.86,86.36 24.13,85.09 25.4,85.09 27.94,83.82 L2.2 | v17.78,92.71 17.78,90.17 | D1.C 76.2,90.17 74.93,88.9 74.93,83.82 73.05,81.94 U2.4 73.99,80.95 v74.93,80.01
  Bottom 0.254: J2.2 25.4,32.92 26.62,31.7 32.92,31.7 34.14,32.92 R3.P$2 | C14.1 115.42,26.62 110.54,21.74 77.22,21.74 76.2,22.76 U1.11 | 80.67,92.05 78.84,93.88 66.04,93.88 64.82,95.1 | 80.67,92.05 82.09,90.63 | 64.82,95.1 R17.P$2 | 82.09,90.63 81.89,90.63 | 82.09,90.63 J3.1 | 80.67,92.05 78.84,90.22 D1.C | R1.P$2 60.96,17.78 62.23,19.05 C5.1 | 64.82,95.1 64.82,95.2 62.23,97.79 19.05,97.79 17.78,96.52 v17.78,92.71 | C16.+ 74.93,73.66 76.2,74.93 D2.C 78.74,74.93 80.01,76.2 80.01,78.74 78.74,80.01 v74.93,80.01
VCAP_MEAS
  Top 0.254: R20.P$2 R19.P$1
  Bottom 0.254: R20.P$2 5.08,48.26 7.62,45.72 19.05,45.72 20.32,44.45 20.32,25.4 21.54,24.18 | U1.8 67.31,24.13 21.59,24.13 21.54,24.18 | 21.54,24.18 10.16,12.8 R21.P$2
VCAP_MEAS_EN
  Bottom 0.254: R12.P$1 68.68,48.16 86.56,48.16 96.52,38.2 U1.22
VIN
  Top 0.254: D5.C 44.3,64.82 40.64,64.82 D4.C 40.64,64.62 39.42,63.4 39.42,57.3 C18.+ | U5.4 17.02,78.23 17.78,77.47 C19.1 19.05,72.39 | 19.05,72.39 20.32,71.12 24.13,71.12 25.4,69.85 Q3.1 | D3.C 12.7,62.23 19.05,68.58 19.05,72.39
  Bottom 0.254: R15.P$2 31.7,57.1 39.22,57.1 C18.+ | 28.85,54.66 29.06,54.66 R15.P$2 | Q3.1 27.94,67.31 29.21,66.04 R15.P$2
VIN2  (via drill 0.51)
  Top 0.254: SV1.3 10.16,72.54 5.08,72.54 SV2.3 | U5.7 17.02,89.66 v16.51,90.17
  Bottom 0.254: v16.51,90.17 13.97,87.63 13.97,81.28 12.7,80.01 12.7,73.66 11.43,72.39 SV1.3 10.16,69.85 11.43,68.58 C22.1
VSUPERCAP_MEAS  (via drill 0.51)
  Top 0.254: U1.9 71.12,22.96 72.54,24.38 72.54,59.84 v76.2,63.5 | U2.1 71.73,76.86 73.66,74.93 74.93,74.93 76.2,73.66 76.2,68.58 D2.A
  Bottom 0.254: R23.P$2 46.99,12.7 49.53,15.24 57.15,15.24 58.42,16.51 58.42,19.05 59.69,20.32 69.85,20.32 71.12,21.59 U1.9 | R22.P$2 87.63,66.04 86.36,64.77 80.01,64.77 78.74,66.04 | D2.A 78.74,66.04 | v76.2,63.5 78.74,66.04

### Text on the board
Top: PIEZO | SOLAR | TEG | DC IN | energy harvesting | demoboard | DANIELE COSTARELLA | ICSP
Bottom: REV 0 - June 2013
tPlace: MEAS | DELAY | SKIP | RFM70 | RST | 1